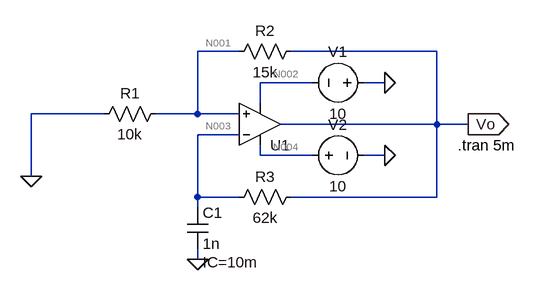
[diagram p0: schematic BP2.asc]
BP2.asc, the LTspice schematic file:
Version 4.1
SHEET 1 880 680
WIRE 224 -16 160 -16
WIRE 528 -16 304 -16
WIRE 336 32 256 32
WIRE 448 32 416 32
WIRE 256 64 256 32
WIRE 16 80 -96 80
WIRE 160 80 160 -16
WIRE 160 80 96 80
WIRE 224 80 160 80
WIRE 528 96 528 -16
WIRE 528 96 288 96
WIRE 576 96 528 96
WIRE 224 112 160 112
WIRE 256 144 256 128
WIRE 336 144 256 144
WIRE 448 144 416 144
WIRE -96 176 -96 80
WIRE 160 208 160 112
WIRE 224 208 160 208
WIRE 528 208 528 96
WIRE 528 208 304 208
WIRE 160 224 160 208
WIRE 160 304 160 288
FLAG 448 144 0
FLAG 448 32 0
FLAG 160 304 0
FLAG -96 176 0
FLAG 576 96 Vo
IOPIN 576 96 Out
SYMBOL OpAmps\\UniversalOpAmp2 256 96 M180
SYMATTR InstName U1
SYMBOL res 112 64 R90
WINDOW 0 0 56 VBottom 2
WINDOW 3 32 56 VTop 2
SYMATTR InstName R1
SYMATTR Value 10k
SYMBOL res 320 -32 R90
WINDOW 0 0 56 VBottom 2
WINDOW 3 32 56 VTop 2
SYMATTR InstName R2
SYMATTR Value 15k
SYMBOL res 320 192 R90
WINDOW 0 0 56 VBottom 2
WINDOW 3 32 56 VTop 2
SYMATTR InstName R3
SYMATTR Value 62k
SYMBOL cap 144 224 R0
WINDOW 39 24 84 Left 2
SYMATTR InstName C1
SYMATTR Value 1n
SYMATTR SpiceLine IC=10m
SYMBOL voltage 432 32 R90
WINDOW 0 -32 56 VBottom 2
WINDOW 3 32 56 VTop 2
WINDOW 123 0 0 Left 0
WINDOW 39 0 0 Left 0
SYMATTR InstName V1
SYMATTR Value 10
SYMBOL voltage 320 144 R270
WINDOW 0 32 56 VTop 2
WINDOW 3 -32 56 VBottom 2
WINDOW 123 0 0 Left 0
WINDOW 39 0 0 Left 0
SYMATTR InstName V2
SYMATTR Value 10
TEXT 560 128 Left 2 !.tran 5m

The netlist it stands for:
* BP2.asc
X§U1 N001 N003 N004 N002 Vo level2 Avol=1Meg GBW=10Meg Slew=10Meg Ilimit=25m Rail=0 Vos=0 En=0 Enk=0 In=0 Ink=0 Rin=500Meg  ; pins In+ In- V+ V- OUT
R1 N001 0 10k
R2 Vo N001 15k
R3 Vo N003 62k
C1 N003 0 1n IC=10m
V1 0 N002 10
V2 N004 0 10
.tran 5m
.lib UniversalOpAmp2.lib
.backanno
.end

* Results of the author's LTspice run, read from the files saved beside the schematic
* Operating Point, zero values left out:
*   V(n001) = 3.998 V
*   V(n002) = -10 V
*   V(n003) = 10 mV
*   V(n004) = 10 V
*   V(vo) = 9.994 V
*   I(C1) = 161 µA
*   I(R1) = 399.8 µA
*   I(R2) = 399.8 µA
*   I(R3) = 161 µA
*   I(V1) = -2.257 µA
*   I(V2) = -562.8 µA
*   Ix(u1:1) = 7.995 nA
*   Ix(u1:2) = 20 pA
*   Ix(u1:3) = 562.8 µA
*   Ix(u1:4) = -2.257 µA
*   Ix(u1:5) = -560.8 µA
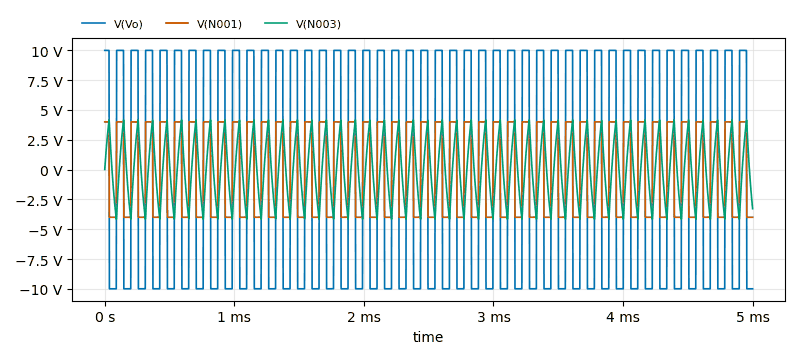
[diagram p1: Transient Analysis of BP2.asc, plotted from the saved traces]
* Transient Analysis, 1 run:
*   V(Vo): min -9.995 V, max 9.995 V, average -26.34 mV, rms 9.883 V, last -9.995 V
*   V(N001): min -3.998 V, max 3.998 V, average -10.54 mV, rms 3.953 V, last -3.998 V
*   V(N003): min -4.163 V, max 4.164 V, average 14.43 mV, rms 2.513 V, last -3.282 V